# EAGLE design rom (EAGLE 9.6.2)
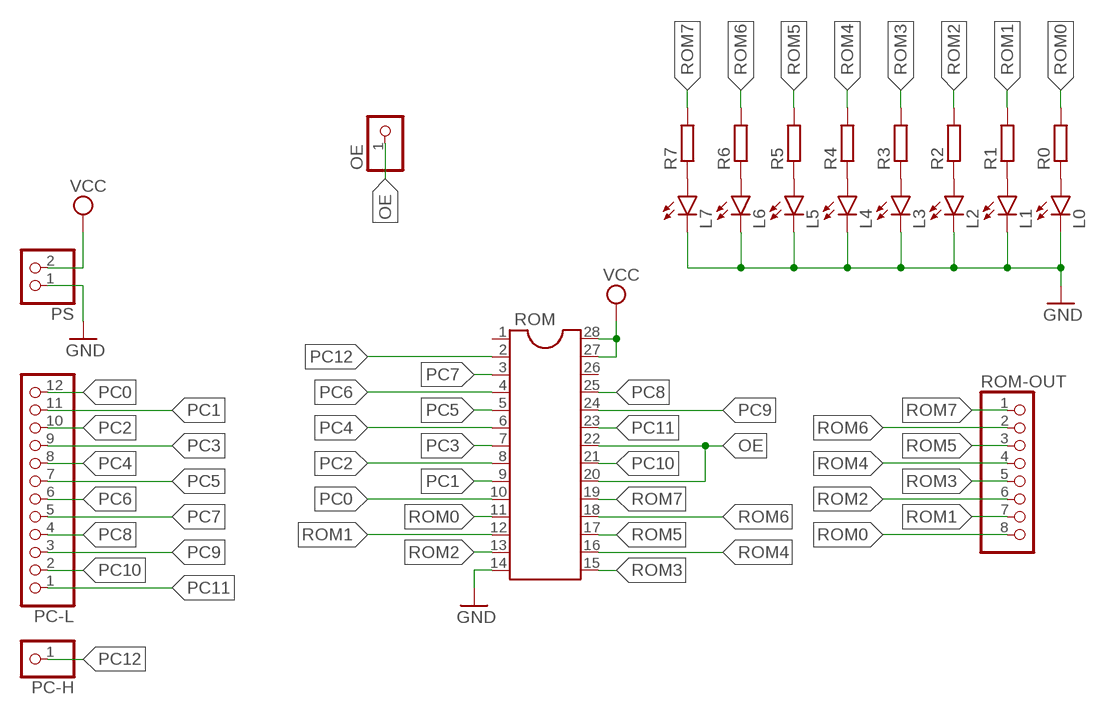
[diagram p0: schematic, sheet 1]

## Parts
L0  LED5MM  [LED5MM]
L1  LED5MM  [LED5MM]
L2  LED5MM  [LED5MM]
L3  LED5MM  [LED5MM]
L4  LED5MM  [LED5MM]
L5  LED5MM  [LED5MM]
L6  LED5MM  [LED5MM]
L7  LED5MM  [LED5MM]
OE  PINHD-1X1  [1X01]
PC-H  PINHD-1X1  [1X01]
PC-L  PINHD-1X12  [1X12]
PS  PINHD-1X2  [1X02]
R0  R-EU_0204/7  [0204/7]
R1  R-EU_0204/7  [0204/7]
R2  R-EU_0204/7  [0204/7]
R3  R-EU_0204/7  [0204/7]
R4  R-EU_0204/7  [0204/7]
R5  R-EU_0204/7  [0204/7]
R6  R-EU_0204/7  [0204/7]
R7  R-EU_0204/7  [0204/7]
ROM  DIL28  [DIL28-6]
ROM-OUT  PINHD-1X8  [1X08]

## Nets
GND: L0.K(C) L1.K(C) L2.K(C) L3.K(C) L4.K(C) L5.K(C) L6.K(C) L7.K(C) PS.1 ROM.14
N$1: L7.A R7.1
N$2: L6.A R6.1
N$3: L5.A R5.1
N$4: L4.A R4.1
N$5: L3.A R3.1
N$6: L2.A R2.1
N$7: L1.A R1.1
N$8: L0.A R0.1
OE: OE.1 ROM.20 ROM.22
PC0: PC-L.12 ROM.10
PC1: PC-L.11 ROM.9
PC2: PC-L.10 ROM.8
PC3: PC-L.9 ROM.7
PC4: PC-L.8 ROM.6
PC5: PC-L.7 ROM.5
PC6: PC-L.6 ROM.4
PC7: PC-L.5 ROM.3
PC8: PC-L.4 ROM.25
PC9: PC-L.3 ROM.24
PC10: PC-L.2 ROM.21
PC11: PC-L.1 ROM.23
PC12: PC-H.1 ROM.2
ROM0: R0.2 ROM-OUT.8 ROM.11
ROM1: R1.2 ROM-OUT.7 ROM.12
ROM2: R2.2 ROM-OUT.6 ROM.13
ROM3: R3.2 ROM-OUT.5 ROM.15
ROM4: R4.2 ROM-OUT.4 ROM.16
ROM5: R5.2 ROM-OUT.3 ROM.17
ROM6: R6.2 ROM-OUT.2 ROM.18
ROM7: R7.2 ROM-OUT.1 ROM.19
VCC: PS.2 ROM.27 ROM.28
Unconnected: ROM.1 ROM.26

## Library data of the parts
L0 L1-L7 = led:LED: LED OSRAM: - CHIPLED LG R971, LG N971, LY N971, LG Q971, LY Q971, LO R971, LY R971 LH N974, LH R974 LS Q976, LO Q976, LY Q976 LO Q996 - Hyper CHIPLED LW Q18S LB Q993, LB Q99A, LB R99A - SideLED LS A670, LO A670, LY A670, LG A670, LP A670 LB A673, LV A673, LT A673, LW A673 LH A674 LY A675 LS A676, LA A676, LO A676, LY A676, LW A676 LS A679, LY A679, LG A679 - Hyper Micro SIDELED® LS Y876, LA Y876, LO Y876, LY Y876 LT Y87S - SmartLED LW L88C, LW L88S LB L89C, LB L89S, LG L890 LS L89K, LO L89K, LY L89K LS L896, LA L896, LO L896, LY L896 - TOPLED LS T670, LO T670, LY T670, LG T670, LP T670 LSG T670, LSP T670, LSY T670, LOP T670, LYG T670 LG T671, LOG T671, LSG T671 LB T673, LV T673, LT T673, LW T673 LH T674 LS T676, LA T676, LO T676, LY T676, LB T676, LH T676, LSB T676, LW T676 LB T67C, LV T67C, LT T67C, LS T67K, LO T67K, LY T67K, LW E67C LS E67B, LA E67B, LO E67B, LY E67B, LB E67C, LV E67C, LT E67C LW T67C LS T679, LY T679, LG T679 LS T770, LO T770, LY T770, LG T770, LP T770 LB T773, LV T773, LT T773, LW T773 LH T774 LS E675, LA E675, LY E675, LS T675 LS T776, LA T776, LO T776, LY T776, LB T776 LHGB T686 LT T68C, LB T68C - Hyper Mini TOPLED® LB M676 - Mini TOPLED Santana® LG M470 LS M47K, LO M47K, LY M47K Source: http://www.osram.convergy.de LUXEON: - LUMILED® LXK2-PW12-R00, LXK2-PW12-S00, LXK2-PW14-U00, LXK2-PW14-V00 LXK2-PM12-R00, LXK2-PM12-S00, LXK2-PM14-U00 LXK2-PE12-Q00, LXK2-PE12-R00, LXK2-PE12-S00, LXK2-PE14-T00, LXK2-PE14-U00 LXK2-PB12-K00, LXK2-PB12-L00, LXK2-PB12-M00, LXK2-PB14-N00, LXK2-PB14-P00, LXK2-PB14-Q00 LXK2-PR12-L00, LXK2-PR12-M00, LXK2-PR14-Q00, LXK2-PR14-R00 LXK2-PD12-Q00, LXK2-PD12-R00, LXK2-PD12-S00 LXK2-PH12-R00, LXK2-PH12-S00 LXK2-PL12-P00, LXK2-PL12-Q00, LXK2-PL12-R00 Source: www.luxeon.com KINGBRIGHT: KA-3528ASYC Source: www.kingbright.com
OE PC-H = pinhead:PINHD-1X1: PIN HEADER
PC-L = pinhead:PINHD-1X12: PIN HEADER
PS = pinhead:PINHD-1X2: PIN HEADER
R0 R1-R7 = rcl:R-EU_: RESISTOR, European symbol; SPICEPREFIX: R
ROM = ic-package:DIL28: Dual In Line
ROM-OUT = pinhead:PINHD-1X8: PIN HEADER

## Board
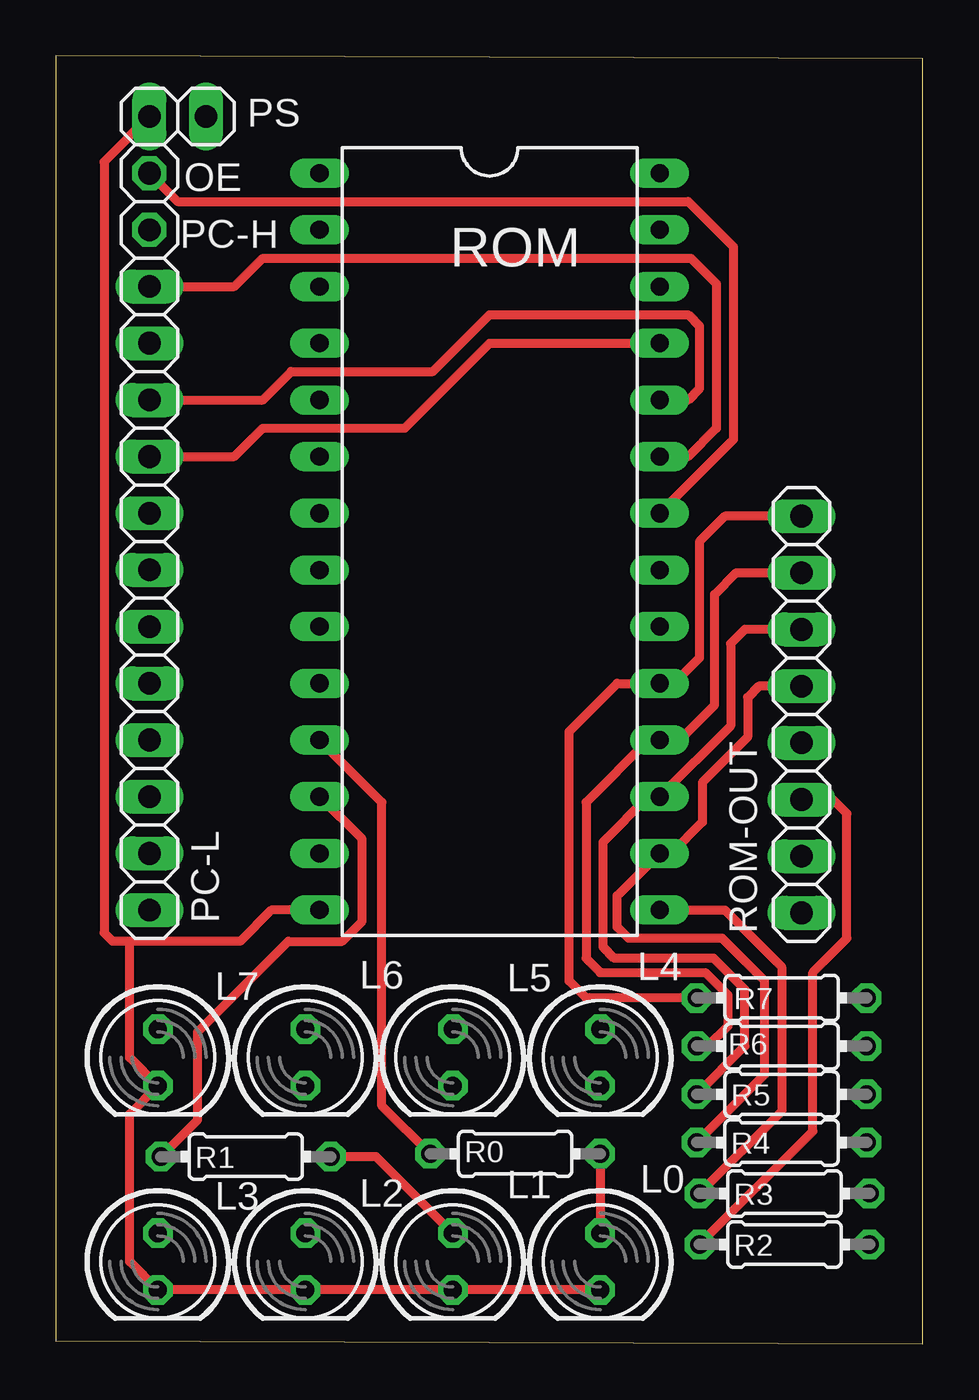
[diagram p1: board, top side]
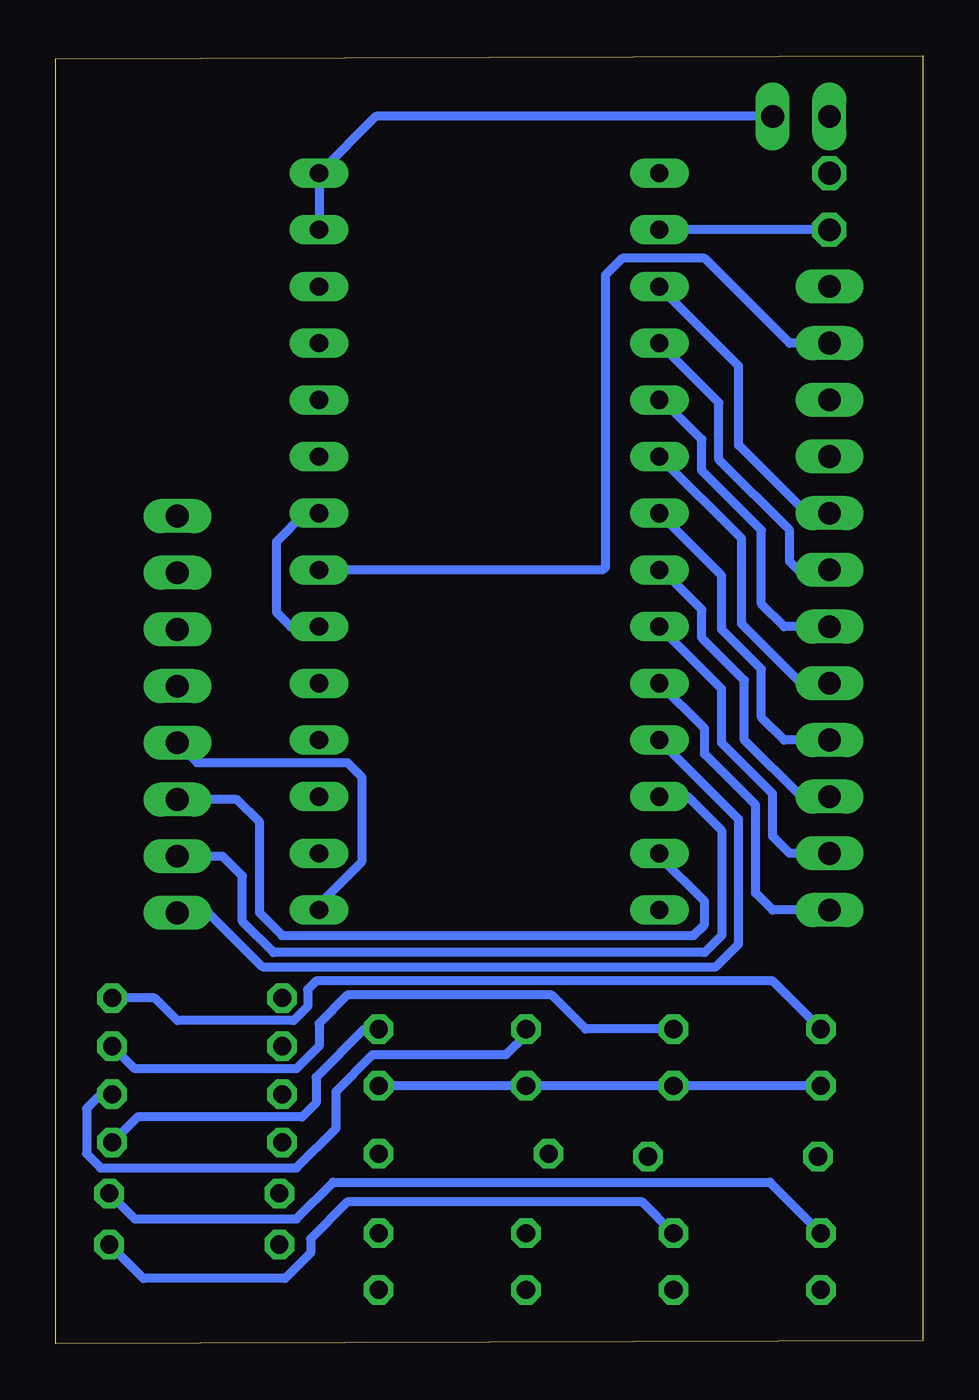
[diagram p2: board, bottom side, seen from below]

Size 38.84 x 57.71 mm. Coordinates in mm from the lower left corner, seen from the top.
Outline: 0,0.13 38.84,0 38.84,57.58 0,57.71 0,0.13
Copper layers (1*16): Top 0.035mm / dielectric 1.5mm / Bottom 0.035mm
Design rules "default": minimum track width 6mil, minimum drill 0.35mm, track to track 6mil, track to pad 6mil, pad to pad 6mil, via to via 6mil, smd to smd 6mil, copper to edge 40mil, drill to drill 6mil, minimum pad ring 10mil, minimum via ring 8mil, stop-mask expansion 4mil, vias tented up to drill 0mil, thermal gap 10mil

### Footprints (pad centres in the part's own frame; a part is rotated, then mirrored left to right if it is on the bottom)
LED5MM = drill 0.813 octagon: A -1.27,0; K 1.27,0
1X01 = drill 1.016 octagon: 1 0,0
1X12 = drill 1.016 long: 1 -13.97,0; 2 -11.43,0; 3 -8.89,0; 4 -6.35,0; 5 -3.81,0; 6 -1.27,0; 7 1.27,0; 8 3.81,0; 9 6.35,0; 10 8.89,0; 11 11.43,0; 12 13.97,0
1X02 = drill 1.016 long: 1 -1.27,0; 2 1.27,0
0204/7 = drill 0.813 octagon: 1 -3.81,0; 2 3.81,0
DIL28-6 = drill 0.813 long: 1 -16.51,-7.62; 2 -13.97,-7.62; 3 -11.43,-7.62; 4 -8.89,-7.62; 5 -6.35,-7.62; 6 -3.81,-7.62; 7 -1.27,-7.62; 8 1.27,-7.62; 9 3.81,-7.62; 10 6.35,-7.62; 11 8.89,-7.62; 12 11.43,-7.62; 13 13.97,-7.62; 14 16.51,-7.62; 15 16.51,7.62; 16 13.97,7.62; 17 11.43,7.62; 18 8.89,7.62; 19 6.35,7.62; 20 3.81,7.62; 21 1.27,7.62; 22 -1.27,7.62; 23 -3.81,7.62; 24 -6.35,7.62; 25 -8.89,7.62; 26 -11.43,7.62; 27 -13.97,7.62; 28 -16.51,7.62
1X08 = drill 1.016 long: 1 -8.89,0; 2 -6.35,0; 3 -3.81,0; 4 -1.27,0; 5 1.27,0; 6 3.81,0; 7 6.35,0; 8 8.89,0

### Placement (x,y rotation side)
L0  24.38,3.68 270 top
L1  17.78,3.68 270 top
L2  11.18,3.68 270 top
L3  4.57,3.68 270 top
L4  24.38,12.83 270 top
L5  17.78,12.83 270 top
L6  11.18,12.83 270 top
L7  4.57,12.83 270 top
OE  4.19,52.45 90 top
PC-H  4.19,49.91 90 top
PC-L  4.19,33.4 270 top
PS  5.46,54.99 0 top
R0  20.57,8.51 180 top
R1  8.51,8.38 180 top
R2  32.64,4.44 180 top
R3  32.64,6.73 180 top
R4  32.51,9.02 180 top
R5  32.51,11.18 180 top
R6  32.51,13.34 180 top
R7  32.51,15.49 180 top
ROM  19.43,35.94 270 top
ROM-OUT  33.4,28.19 270 top

### Tracks (layer width: path | path; a pad name or v marks a point on that pad's centre or on a via)
GND
  Top 0.4: ROM.14 9.65,19.43 8.26,18.03 3.3,18.03 | 3.3,18.03 2.54,18.03 2.16,18.41 2.16,52.96 PS.1 | L0.K L1.K L2.K L3.K 3.3,3.68 3.3,10.29 L7.K 3.3,12.83 3.3,18.03
  Bottom 0.4: L7.K L6.K L5.K L4.K
N$1
  Bottom 0.4: L7.A 6.73,16.26 27.18,16.26 27.56,15.88 27.56,15.11 28.19,14.48 33.4,14.48 34.42,15.49 R7.1
N$2
  Bottom 0.4: L6.A 15.11,14.1 16.64,15.62 25.78,15.62 27.05,14.35 27.05,13.34 28.07,12.32 35.31,12.32 R6.1
N$3
  Bottom 0.4: R5.1 36.83,11.18 37.47,10.54 37.47,8.51 36.83,7.87 28.07,7.87 26.29,9.65 26.29,11.3 24.64,12.95 18.67,12.95 17.78,13.84 L5.A
N$4
  Bottom 0.4: L4.A 25.02,14.1 27.18,11.94 27.18,10.79 27.81,10.16 35.18,10.16 R4.1
N$5
  Bottom 0.4: R3.1 35.31,5.59 28.07,5.59 26.42,7.24 6.86,7.24 L3.A
N$6
  Bottom 0.4: L2.A 12.57,6.35 25.78,6.35 27.43,4.7 27.43,4.06 28.57,2.92 34.92,2.92 R2.1
N$7
  Top 0.4: L1.A 14.35,8.38 R1.1
N$8
  Top 0.4: R0.1 L0.A
OE
  Top 0.4: OE.1 5.46,51.18 28.32,51.18 30.35,49.15 30.35,40.51 ROM.22
  Bottom 0.4: ROM.20 28.32,32.13 28.96,32.77 28.96,35.94 27.69,37.21 ROM.22
PC0
  Bottom 0.4: ROM.10 9.78,27.56 9.78,26.42 7.49,24.13 7.49,20.19 6.73,19.43 PC-L.12
PC1
  Bottom 0.4: ROM.9 9.02,29.34 9.02,26.92 6.73,24.64 6.73,22.73 5.97,21.97 PC-L.11
PC2
  Bottom 0.4: ROM.8 11.68,34.67 9.91,32.89 9.91,31.62 8,29.72 8,27.05 5.46,24.51 PC-L.10
PC3
  Bottom 0.4: ROM.7 9.02,34.42 9.02,32 7.24,30.23 7.24,28.07 6.22,27.05 PC-L.9
PC4
  Bottom 0.4: ROM.6 8.13,36.07 8.13,32.26 5.46,29.59 PC-L.8
PC5
  Bottom 0.4: ROM.5 11.68,42.29 9.91,40.51 9.91,39.12 7.24,36.45 7.24,33.15 6.22,32.13 PC-L.7
PC6
  Bottom 0.4: ROM.4 9.14,42.16 9.14,39.62 5.97,36.45 5.97,35.05 5.59,34.67 PC-L.6
PC7
  Bottom 0.4: ROM.3 8.26,43.82 8.26,40.26 5.21,37.21 PC-L.5
PC8
  Top 0.4: ROM.25 19.43,44.83 15.62,41.02 9.27,41.02 8,39.75 PC-L.4
PC9
  Top 0.4: ROM.24 28.32,42.29 28.83,42.8 28.83,45.59 28.32,46.1 19.43,46.1 16.89,43.56 10.54,43.56 9.27,42.29 PC-L.3
PC10
  Bottom 0.4: ROM.21 14.35,34.67 14.22,34.8 14.22,47.88 13.46,48.64 9.78,48.64 5.97,44.83 PC-L.2
PC11
  Top 0.4: ROM.23 28.32,39.75 29.59,41.02 29.59,47.5 28.45,48.64 9.27,48.64 8,47.37 PC-L.1
PC12
  Bottom 0.4: PC-H.1 ROM.2
ROM0
  Top 0.4: ROM.11 14.61,24.26 14.61,10.67 R0.2
  Bottom 0.4: ROM-OUT.8 32,19.3 29.59,16.89 9.27,16.89 8.26,17.91 8.26,23.49 ROM.11
ROM1
  Top 0.4: R1.2 6.35,10.03 6.35,13.97 10.41,18.03 12.83,18.03 13.72,18.92 13.72,22.61 ROM.12
  Bottom 0.4: ROM.12 10.54,24.51 9.02,22.99 9.02,18.29 9.78,17.53 29.08,17.53 30.48,18.92 30.48,20.95 31.37,21.84 ROM-OUT.7
ROM2
  Top 0.4: ROM-OUT.6 34.8,24.38 35.43,23.75 35.43,18.16 33.91,16.64 33.91,9.53 R2.2
  Bottom 0.4: ROM.13 11.81,21.84 9.78,19.81 9.78,18.8 10.29,18.29 28.7,18.29 29.72,19.3 29.72,23.37 30.73,24.38 ROM-OUT.6
ROM3
  Top 0.4: ROM.15 29.97,19.43 32.51,16.89 32.51,10.41 R3.2
  Bottom 0.4: ROM-OUT.5 32.51,26.04 25.78,26.04 25.15,25.4 25.15,21.59 27.05,19.68 ROM.15
ROM4
  Top 0.4: R4.2 31.75,12.07 31.75,16.26 29.84,18.16 25.65,18.16 25.15,18.67 25.15,20.07 ROM.16 27.56,21.97 28.96,23.37 28.96,25.15 30.99,27.18 30.99,28.96 31.5,29.46 ROM-OUT.4
ROM5
  Top 0.4: R5.2 30.86,13.34 30.86,15.88 29.46,17.27 25.02,17.27 24.51,17.78 24.51,22.48 26.54,24.51 ROM.17 30.23,27.69 30.23,31.37 30.86,32 ROM-OUT.3
ROM6
  Top 0.4: R6.2 29.21,13.34 30.1,14.22 30.1,15.62 29.08,16.64 24.38,16.64 23.75,17.27 23.75,24.26 26.54,27.05 ROM.18 27.94,27.05 29.51,28.62 29.51,33.57 30.48,34.54 ROM-OUT.2
ROM7
  Top 0.4: R7.2 23.75,15.49 22.99,16.26 22.99,27.43 25.15,29.59 ROM.19 27.69,29.59 28.83,30.73 28.83,35.94 29.97,37.08 ROM-OUT.1
VCC
  Bottom 0.4: PS.2 24.51,54.99 ROM.28 ROM.27